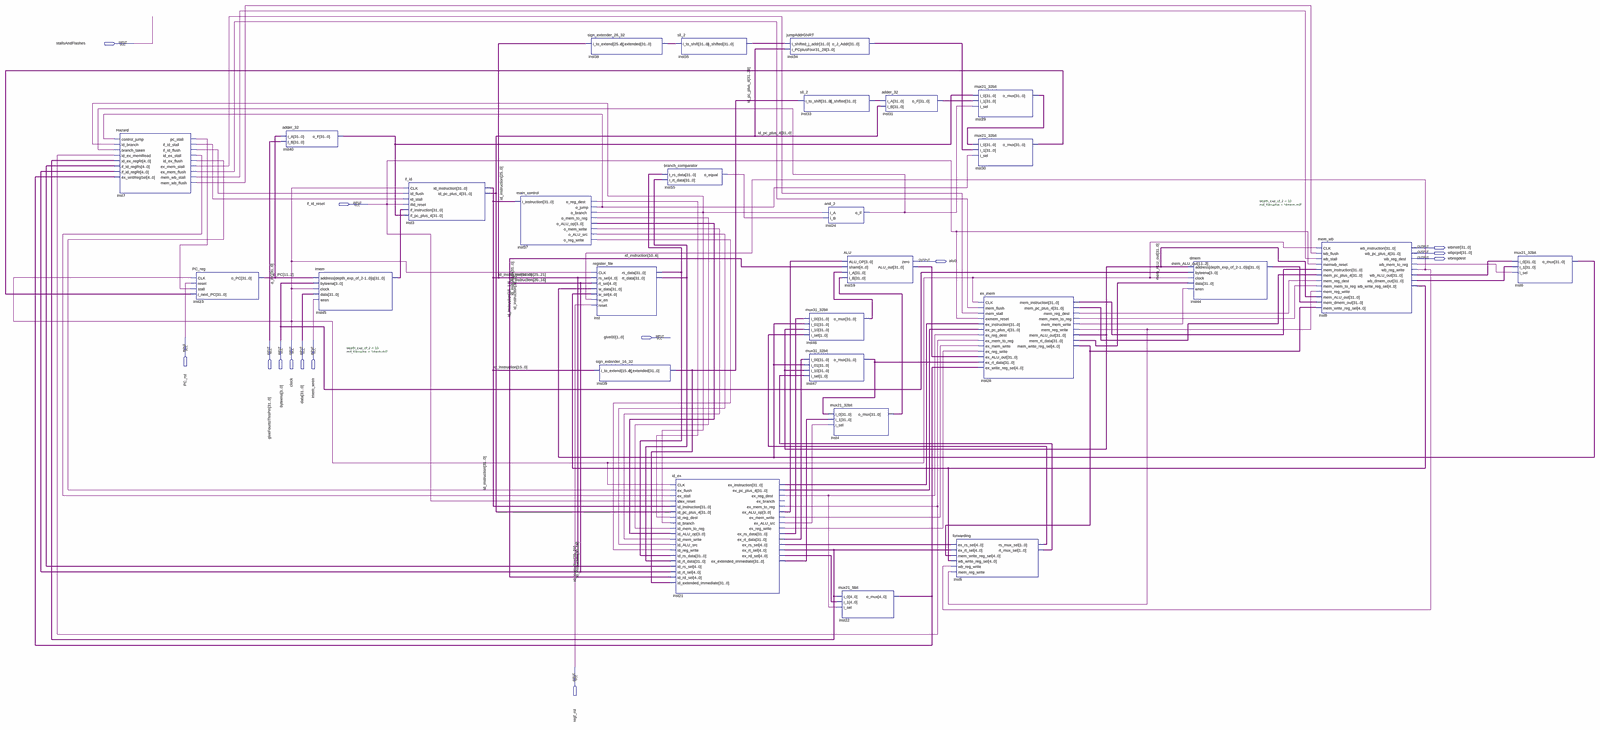
[diagram p0: schematic sheet, whole]
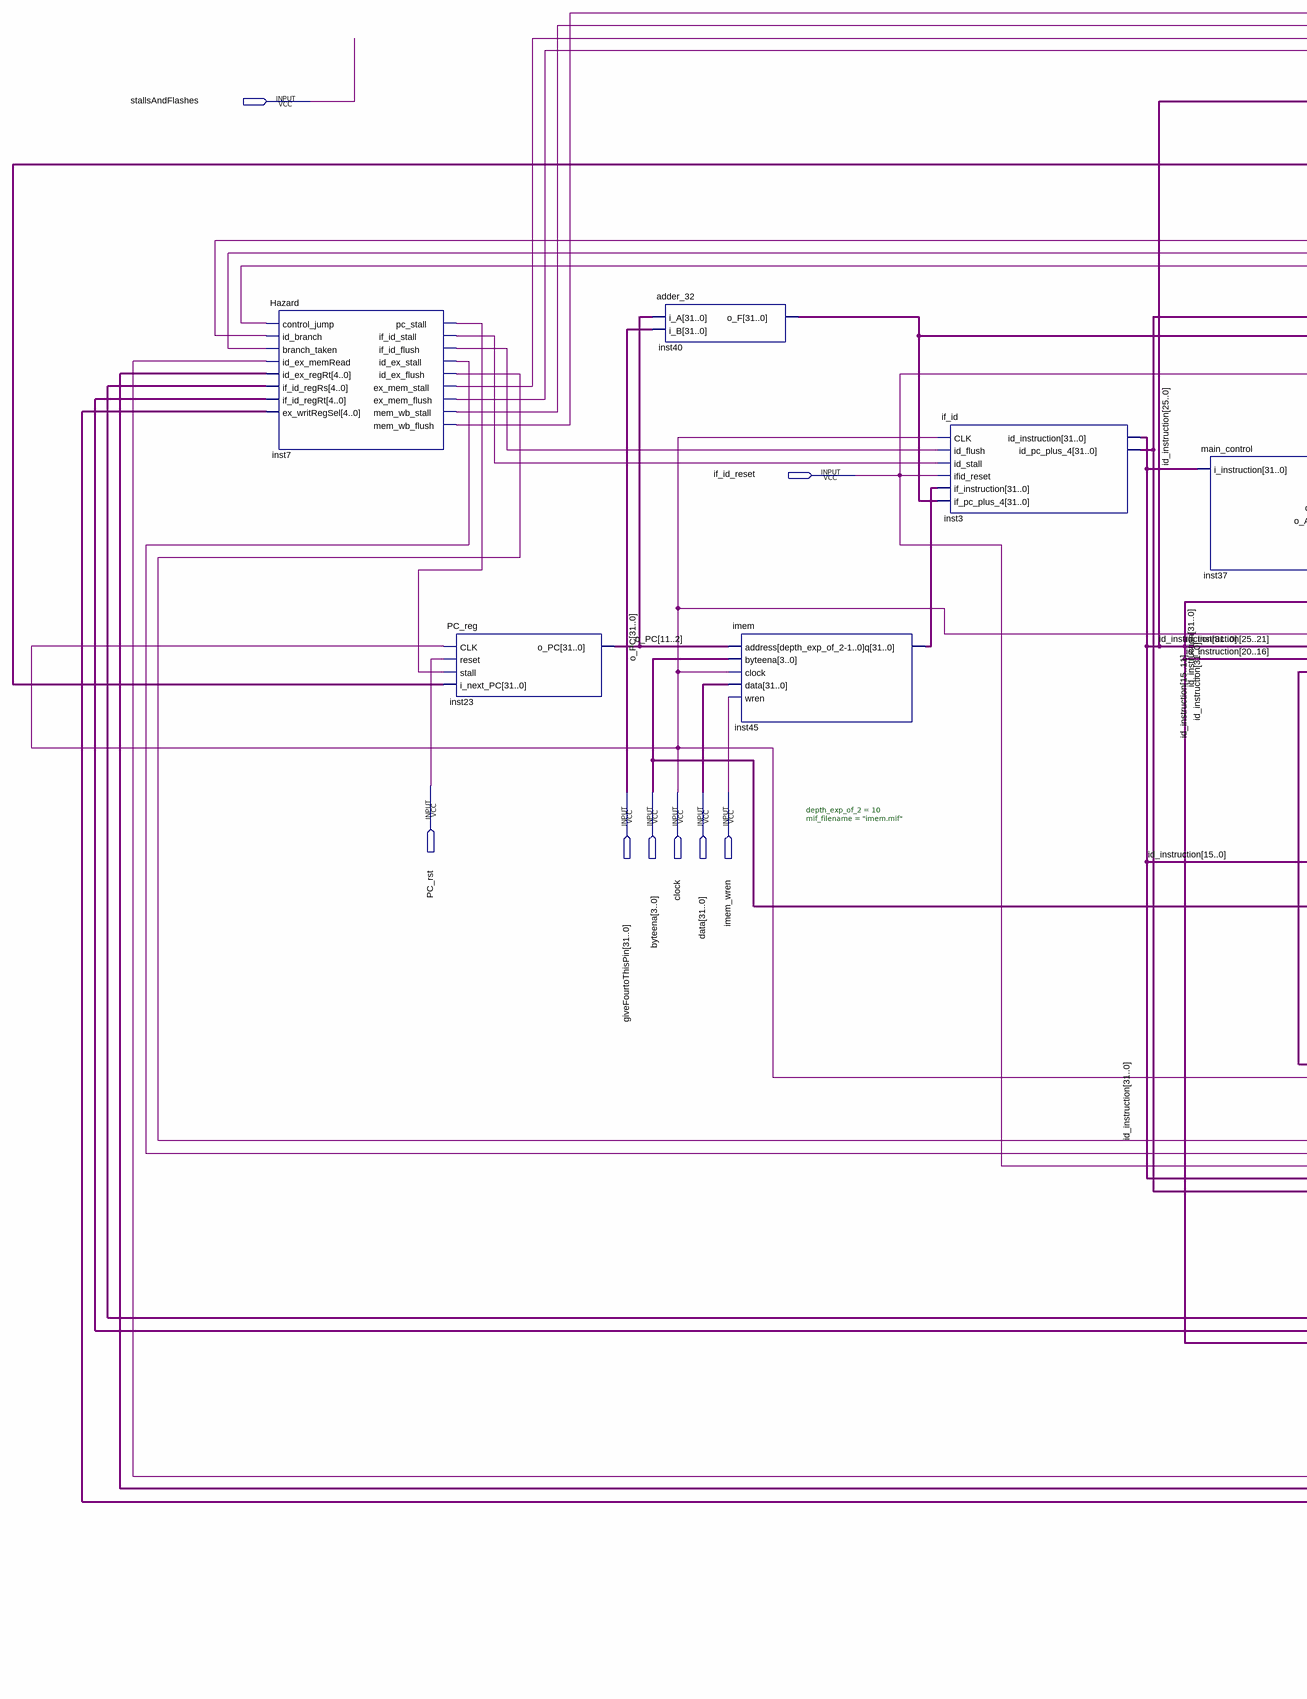
[diagram p1: schematic sheet, left part]
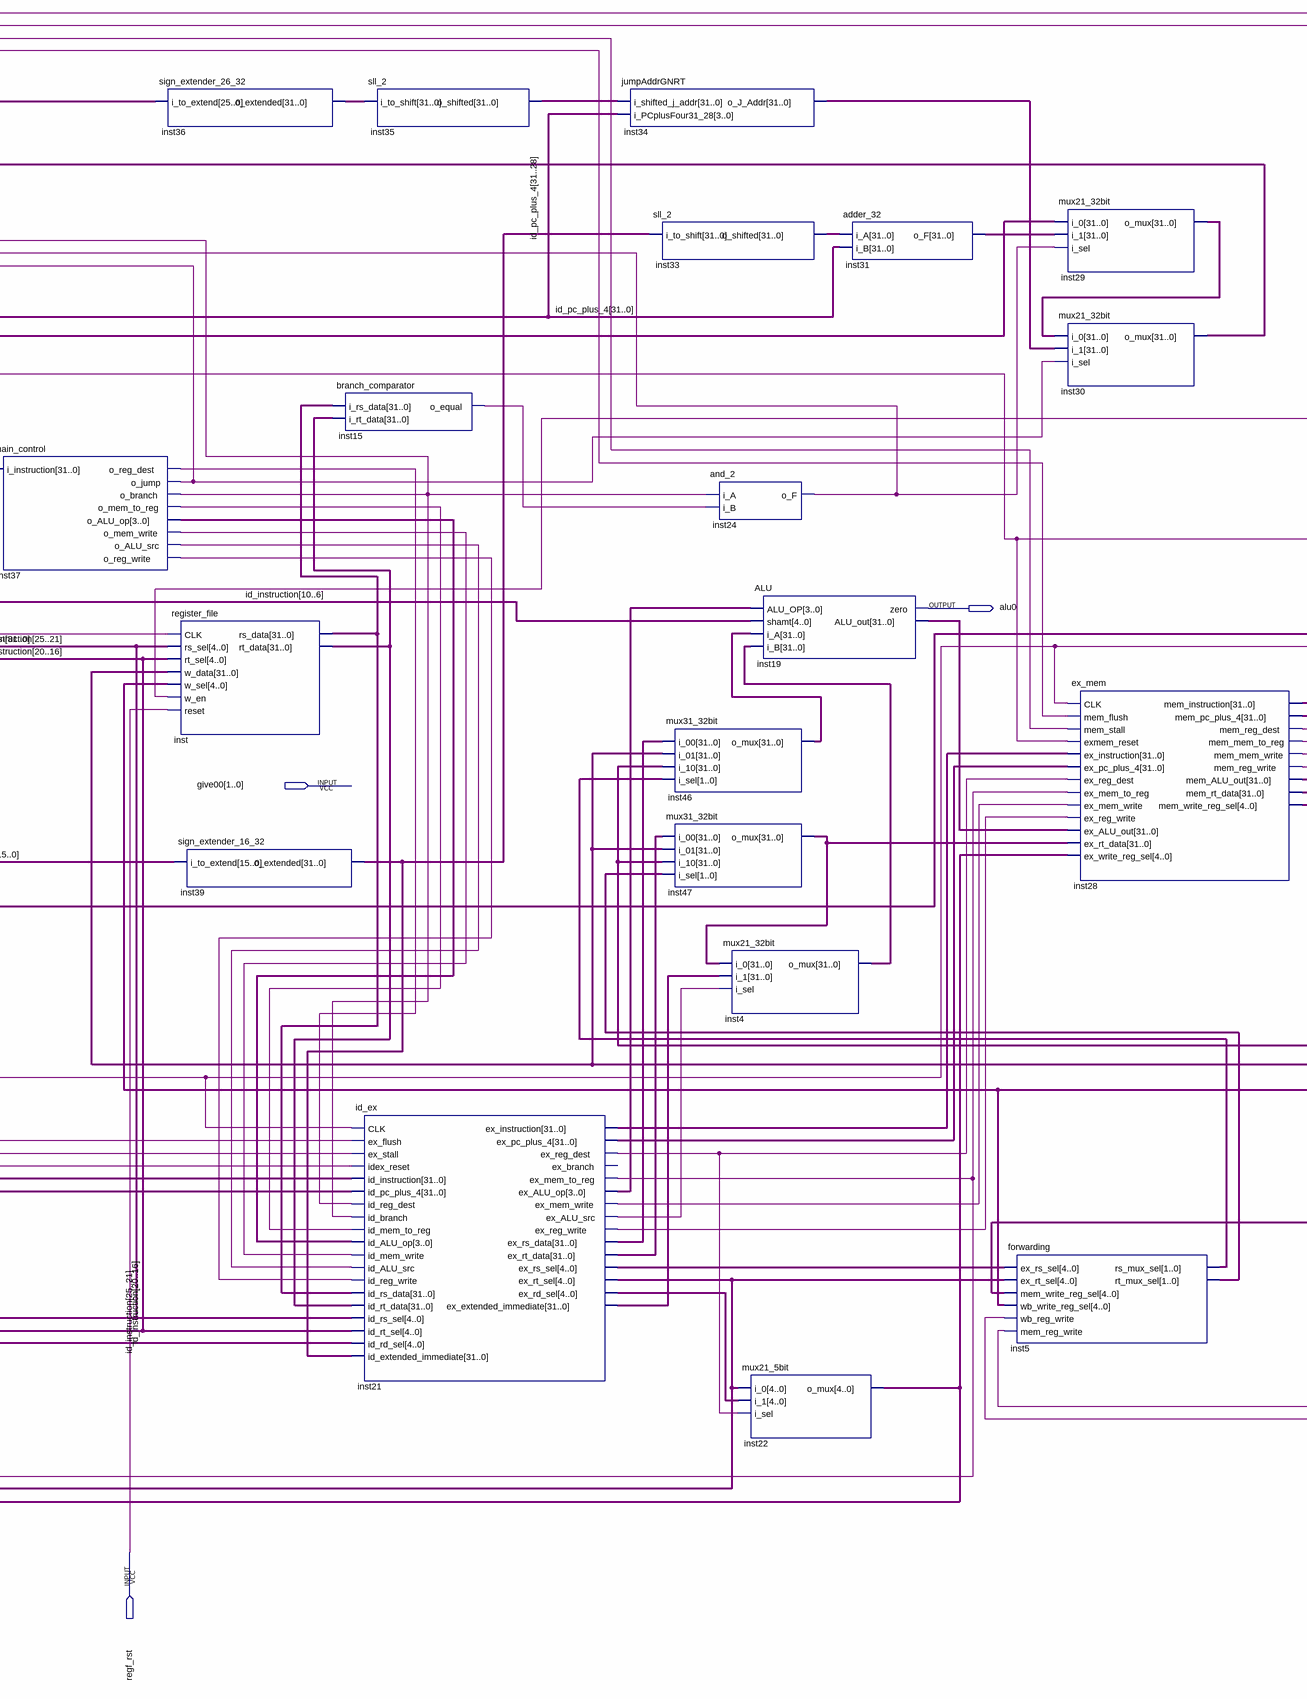
[diagram p2: schematic sheet, centre part]
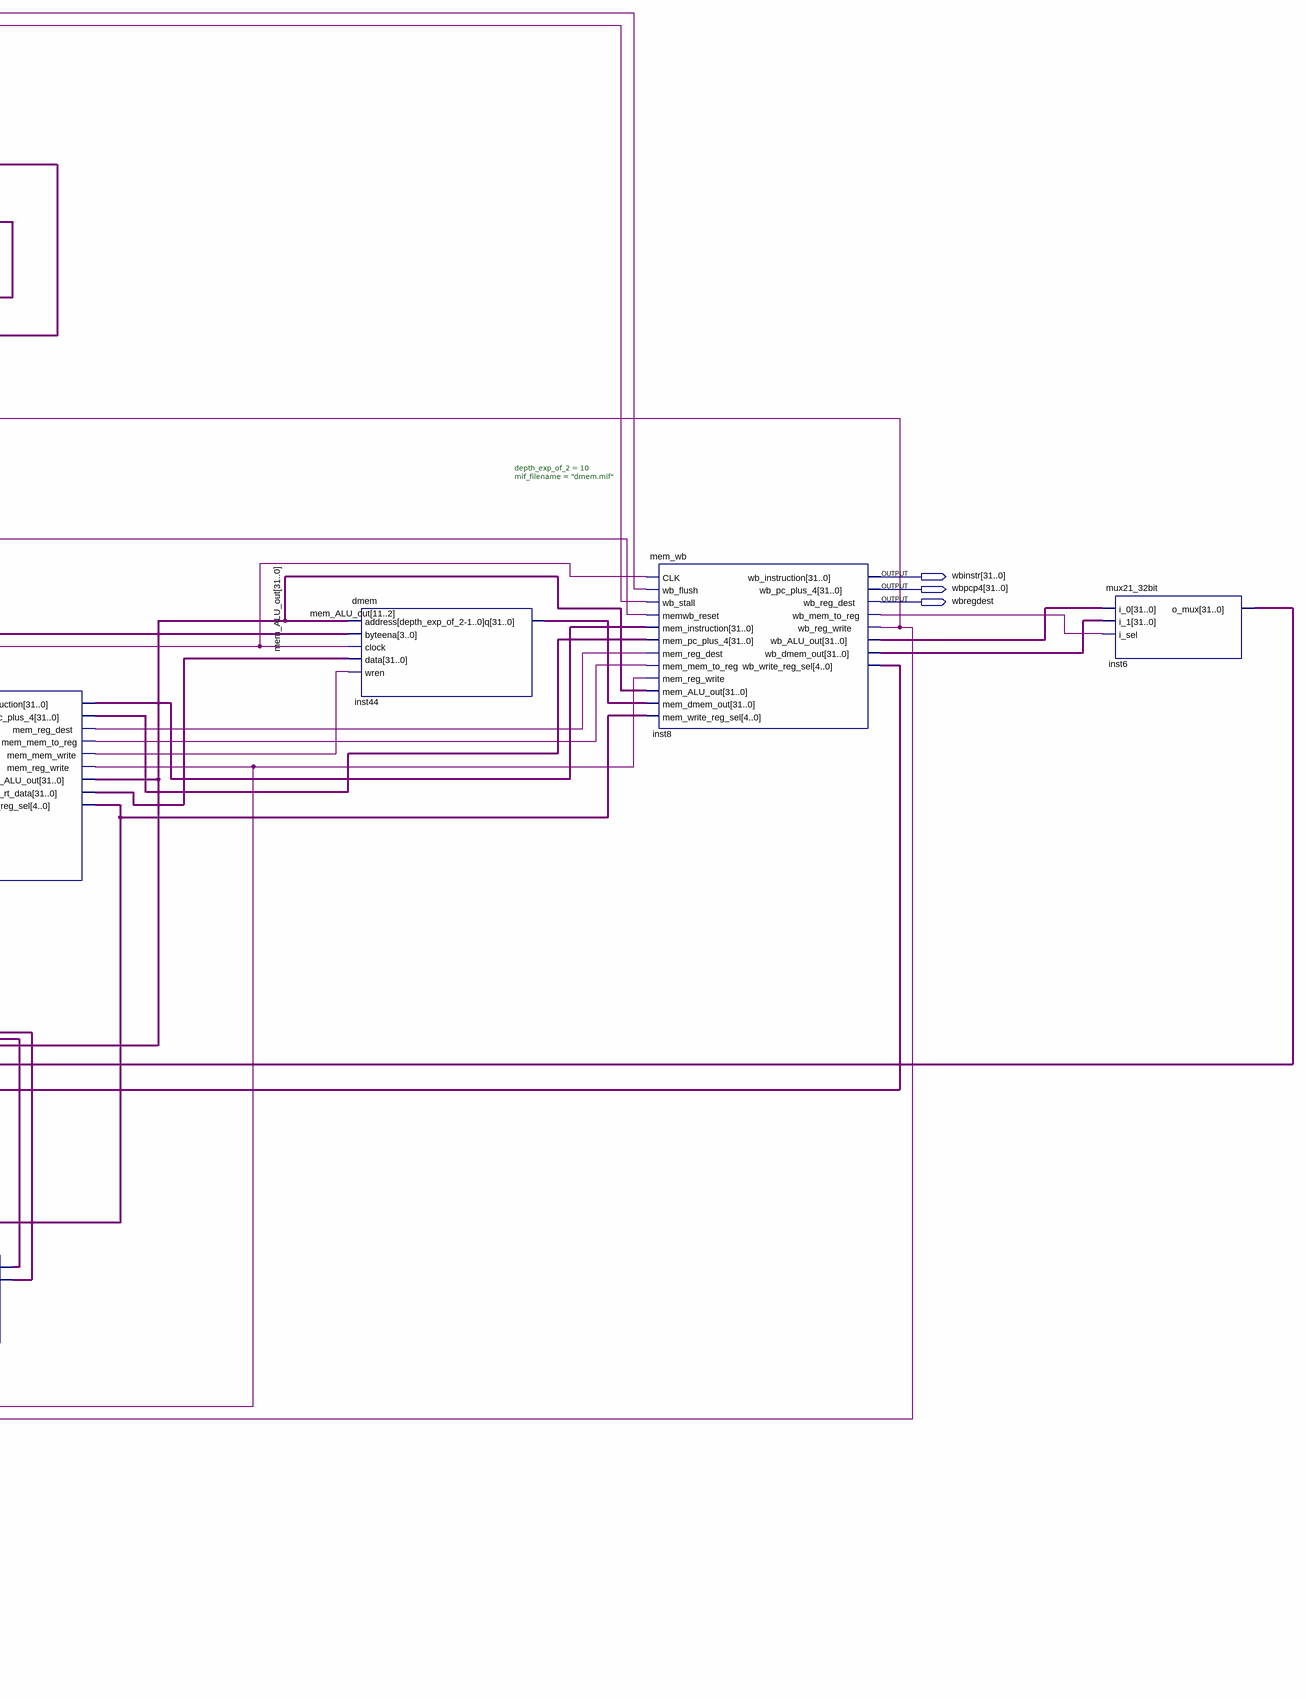
[diagram p3: schematic sheet, right part]
// Quartus schematic projectB.bdf as structural Verilog: 28 symbols, 14 pins
module projectB (
  input  stallsAndFlashes,
  input  if_id_reset,
  input  PC_rst,
  input  [1:0] give00,
  input  [31:0] giveFourtoThisPin,
  input  [3:0] byteena,
  input  clock,
  input  [31:0] data,
  input  imem_wren,
  input  regf_rst,
  output [31:0] wbinstr,
  output [31:0] wbpcp4,
  output wbregdest,
  output alu0
);

  wire inst7_ex_mem_flush, inst7_ex_mem_stall, inst7_id_ex_flush, inst7_id_ex_stall, inst7_if_id_flush,
       inst7_if_id_stall, inst7_mem_wb_flush, inst7_mem_wb_stall, inst7_pc_stall, inst8_wb_mem_to_reg,
       inst8_wb_reg_write, inst15_o_equal, inst21_ex_alu_src, inst21_ex_mem_to_reg, inst21_ex_mem_write,
       inst21_ex_reg_dest, inst21_ex_reg_write, inst24_o_f, inst28_mem_mem_to_reg, inst28_mem_mem_write,
       inst28_mem_reg_dest, inst28_mem_reg_write, inst37_o_alu_src, inst37_o_branch, inst37_o_jump,
       inst37_o_mem_to_reg, inst37_o_mem_write, inst37_o_reg_dest, inst37_o_reg_write;
  wire [1:0] inst5_rs_mux_sel, inst5_rt_mux_sel;
  wire [3:0] inst21_ex_alu_op, inst37_o_alu_op;
  wire [4:0] inst8_wb_write_reg_sel, inst21_ex_rd_sel, inst21_ex_rs_sel, inst21_ex_rt_sel, inst22_o_mux,
       inst28_mem_write_reg_sel;
  wire [31:0] id_instruction, id_pc_plus_4, inst4_o_mux, inst6_o_mux, inst8_wb_alu_out, inst8_wb_dmem_out,
       inst19_alu_out, inst21_ex_extended_immediate, inst21_ex_instruction, inst21_ex_pc_plus_4,
       inst21_ex_rs_data, inst21_ex_rt_data, inst28_mem_instruction, inst28_mem_pc_plus_4,
       inst28_mem_rt_data, inst29_o_mux, inst30_o_mux, inst31_o_f, inst33_o_shifted, inst34_o_j_addr,
       inst35_o_shifted, inst36_o_extended, inst39_o_extended, inst40_o_f, inst44_q, inst45_q, inst46_o_mux,
       inst47_o_mux, inst_rs_data, inst_rt_data, mem_ALU_out, o_PC;

  Hazard inst7 (
    .control_jump(inst37_o_jump), .id_branch(inst37_o_branch), .branch_taken(inst24_o_f),
    .id_ex_memRead(inst21_ex_mem_to_reg), .id_ex_regRt(inst21_ex_rt_sel),
    .if_id_regRs(id_instruction[25:21]), .if_id_regRt(id_instruction[20:16]), .ex_writRegSel(inst22_o_mux),
    .pc_stall(inst7_pc_stall), .if_id_stall(inst7_if_id_stall), .if_id_flush(inst7_if_id_flush),
    .id_ex_stall(inst7_id_ex_stall), .id_ex_flush(inst7_id_ex_flush), .ex_mem_stall(inst7_ex_mem_stall),
    .ex_mem_flush(inst7_ex_mem_flush), .mem_wb_stall(inst7_mem_wb_stall), .mem_wb_flush(inst7_mem_wb_flush));
  PC_reg inst23 (.CLK(clock), .reset(PC_rst), .stall(inst7_pc_stall), .i_next_PC(inst30_o_mux), .o_PC(o_PC));
  adder_32 inst40 (.i_A(o_PC), .i_B(giveFourtoThisPin), .o_F(inst40_o_f));
  imem #(.depth_exp_of_2(10), .mif_filename("imem.mif")) inst45 (
    .address(o_PC[11:2]), .byteena(byteena), .clock(clock), .data(data), .wren(imem_wren), .q(inst45_q));
  if_id inst3 (
    .CLK(clock), .id_flush(inst7_if_id_flush), .id_stall(inst7_if_id_stall), .ifid_reset(if_id_reset),
    .if_instruction(inst45_q), .if_pc_plus_4(inst40_o_f), .id_instruction(id_instruction),
    .id_pc_plus_4(id_pc_plus_4));
  main_control inst37 (
    .i_instruction(id_instruction), .o_reg_dest(inst37_o_reg_dest), .o_jump(inst37_o_jump),
    .o_branch(inst37_o_branch), .o_mem_to_reg(inst37_o_mem_to_reg), .o_ALU_op(inst37_o_alu_op),
    .o_mem_write(inst37_o_mem_write), .o_ALU_src(inst37_o_alu_src), .o_reg_write(inst37_o_reg_write));
  sign_extender_26_32 inst36 (.i_to_extend(id_instruction[25:0]), .o_extended(inst36_o_extended));
  register_file inst (
    .CLK(clock), .rs_sel(id_instruction[25:21]), .rt_sel(id_instruction[20:16]), .w_data(inst6_o_mux),
    .w_sel(inst8_wb_write_reg_sel), .w_en(inst8_wb_reg_write), .reset(regf_rst), .rs_data(inst_rs_data),
    .rt_data(inst_rt_data));
  sign_extender_16_32 inst39 (.i_to_extend(id_instruction[15:0]), .o_extended(inst39_o_extended));
  sll_2 inst35 (.i_to_shift(inst36_o_extended), .o_shifted(inst35_o_shifted));
  branch_comparator inst15 (.i_rs_data(inst_rs_data), .i_rt_data(inst_rt_data), .o_equal(inst15_o_equal));
  id_ex inst21 (
    .CLK(clock), .ex_flush(inst7_id_ex_flush), .ex_stall(inst7_id_ex_stall), .idex_reset(if_id_reset),
    .id_instruction(id_instruction), .id_pc_plus_4(id_pc_plus_4), .id_reg_dest(inst37_o_reg_dest),
    .id_branch(inst37_o_branch), .id_mem_to_reg(inst37_o_mem_to_reg), .id_ALU_op(inst37_o_alu_op),
    .id_mem_write(inst37_o_mem_write), .id_ALU_src(inst37_o_alu_src), .id_reg_write(inst37_o_reg_write),
    .id_rs_data(inst_rs_data), .id_rt_data(inst_rt_data), .id_rs_sel(id_instruction[25:21]),
    .id_rt_sel(id_instruction[20:16]), .id_rd_sel(id_instruction[15:11]),
    .id_extended_immediate(inst39_o_extended), .ex_instruction(inst21_ex_instruction),
    .ex_pc_plus_4(inst21_ex_pc_plus_4), .ex_reg_dest(inst21_ex_reg_dest),
    .ex_mem_to_reg(inst21_ex_mem_to_reg), .ex_ALU_op(inst21_ex_alu_op), .ex_mem_write(inst21_ex_mem_write),
    .ex_ALU_src(inst21_ex_alu_src), .ex_reg_write(inst21_ex_reg_write), .ex_rs_data(inst21_ex_rs_data),
    .ex_rt_data(inst21_ex_rt_data), .ex_rs_sel(inst21_ex_rs_sel), .ex_rt_sel(inst21_ex_rt_sel),
    .ex_rd_sel(inst21_ex_rd_sel), .ex_extended_immediate(inst21_ex_extended_immediate));  // open: ex_branch
  jumpAddrGNRT inst34 (
    .i_shifted_j_addr(inst35_o_shifted), .i_PCplusFour31_28(id_pc_plus_4[31:28]), .o_J_Addr(inst34_o_j_addr));
  sll_2 inst33 (.i_to_shift(inst39_o_extended), .o_shifted(inst33_o_shifted));
  mux31_32bit inst46 (
    .i_00(inst21_ex_rs_data), .i_01(inst6_o_mux), .i_10(mem_ALU_out), .i_sel(inst5_rs_mux_sel),
    .o_mux(inst46_o_mux));
  mux31_32bit inst47 (
    .i_00(inst21_ex_rt_data), .i_01(inst6_o_mux), .i_10(mem_ALU_out), .i_sel(inst5_rt_mux_sel),
    .o_mux(inst47_o_mux));
  and_2 inst24 (.i_A(inst37_o_branch), .i_B(inst15_o_equal), .o_F(inst24_o_f));
  mux21_32bit inst4 (
    .i_0(inst47_o_mux), .i_1(inst21_ex_extended_immediate), .i_sel(inst21_ex_alu_src), .o_mux(inst4_o_mux));
  ALU inst19 (
    .ALU_OP(inst21_ex_alu_op), .shamt(id_instruction[10:6]), .i_A(inst46_o_mux), .i_B(inst4_o_mux),
    .zero(alu0), .ALU_out(inst19_alu_out));
  mux21_5bit inst22 (.i_0(inst21_ex_rt_sel), .i_1(inst21_ex_rd_sel), .i_sel(inst21_ex_reg_dest), .o_mux(inst22_o_mux));
  adder_32 inst31 (.i_A(inst33_o_shifted), .i_B(id_pc_plus_4), .o_F(inst31_o_f));
  forwarding inst5 (
    .ex_rs_sel(inst21_ex_rs_sel), .ex_rt_sel(inst21_ex_rt_sel), .mem_write_reg_sel(inst28_mem_write_reg_sel),
    .wb_write_reg_sel(inst8_wb_write_reg_sel), .wb_reg_write(inst8_wb_reg_write),
    .mem_reg_write(inst28_mem_reg_write), .rs_mux_sel(inst5_rs_mux_sel), .rt_mux_sel(inst5_rt_mux_sel));
  mux21_32bit inst29 (.i_0(inst40_o_f), .i_1(inst31_o_f), .i_sel(inst24_o_f), .o_mux(inst29_o_mux));
  mux21_32bit inst30 (.i_0(inst29_o_mux), .i_1(inst34_o_j_addr), .i_sel(inst37_o_jump), .o_mux(inst30_o_mux));
  ex_mem inst28 (
    .CLK(clock), .mem_flush(inst7_ex_mem_flush), .mem_stall(inst7_ex_mem_stall), .exmem_reset(if_id_reset),
    .ex_instruction(inst21_ex_instruction), .ex_pc_plus_4(inst21_ex_pc_plus_4),
    .ex_reg_dest(inst21_ex_reg_dest), .ex_mem_to_reg(inst21_ex_mem_to_reg),
    .ex_mem_write(inst21_ex_mem_write), .ex_reg_write(inst21_ex_reg_write), .ex_ALU_out(inst19_alu_out),
    .ex_rt_data(inst47_o_mux), .ex_write_reg_sel(inst22_o_mux), .mem_instruction(inst28_mem_instruction),
    .mem_pc_plus_4(inst28_mem_pc_plus_4), .mem_reg_dest(inst28_mem_reg_dest),
    .mem_mem_to_reg(inst28_mem_mem_to_reg), .mem_mem_write(inst28_mem_mem_write),
    .mem_reg_write(inst28_mem_reg_write), .mem_ALU_out(mem_ALU_out), .mem_rt_data(inst28_mem_rt_data),
    .mem_write_reg_sel(inst28_mem_write_reg_sel));
  dmem #(.depth_exp_of_2(10), .mif_filename("dmem.mif")) inst44 (
    .address(mem_ALU_out[11:2]), .byteena(byteena), .clock(clock), .data(inst28_mem_rt_data),
    .wren(inst28_mem_mem_write), .q(inst44_q));
  mem_wb inst8 (
    .CLK(clock), .wb_flush(inst7_mem_wb_flush), .wb_stall(inst7_mem_wb_stall), .memwb_reset(if_id_reset),
    .mem_instruction(inst28_mem_instruction), .mem_pc_plus_4(inst28_mem_pc_plus_4),
    .mem_reg_dest(inst28_mem_reg_dest), .mem_mem_to_reg(inst28_mem_mem_to_reg),
    .mem_reg_write(inst28_mem_reg_write), .mem_ALU_out(mem_ALU_out), .mem_dmem_out(inst44_q),
    .mem_write_reg_sel(inst28_mem_write_reg_sel), .wb_instruction(wbinstr), .wb_pc_plus_4(wbpcp4),
    .wb_reg_dest(wbregdest), .wb_mem_to_reg(inst8_wb_mem_to_reg), .wb_reg_write(inst8_wb_reg_write),
    .wb_ALU_out(inst8_wb_alu_out), .wb_dmem_out(inst8_wb_dmem_out), .wb_write_reg_sel(inst8_wb_write_reg_sel));
  mux21_32bit inst6 (.i_0(inst8_wb_alu_out), .i_1(inst8_wb_dmem_out), .i_sel(inst8_wb_mem_to_reg), .o_mux(inst6_o_mux));
endmodule
